# Altium project PCB_Project1.PrjPCB
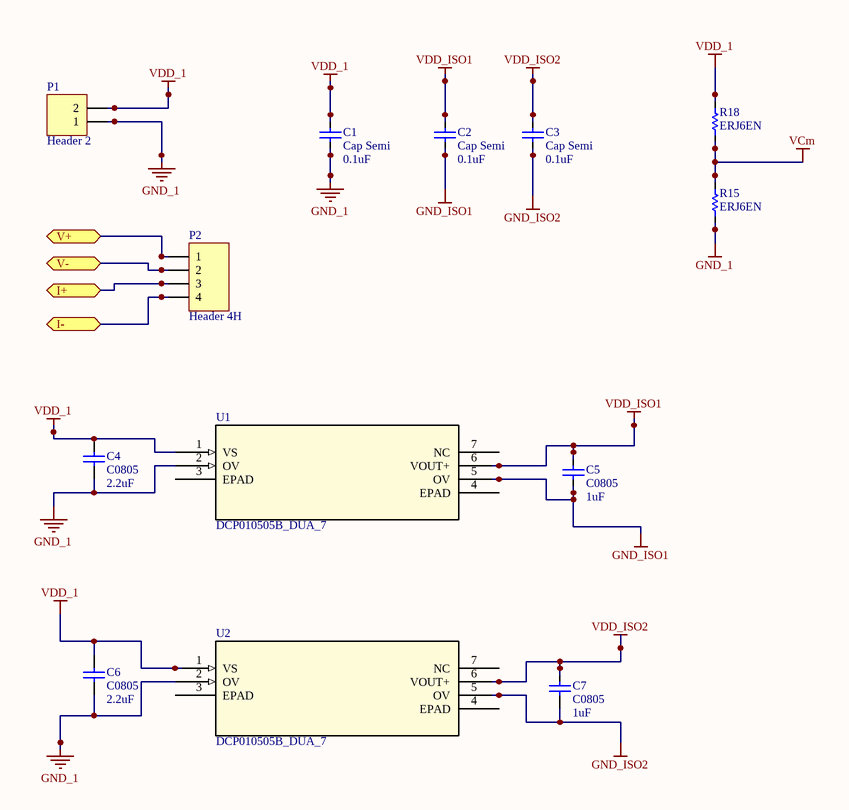
[diagram p0: Sheet1.SchDoc]
3 sheets, 40 parts. Net scope: flat (ports and power ports of the same name join across sheets).
Board file: PCB1.PcbDoc
Sheets:
  Sheet1.SchDoc
  Sheet2.SchDoc
  Sheet3.SchDoc

## Sheet Sheet1.SchDoc
size A4

### Parts
C1  Cap Semi  value 0.1uF  [C1206]
C2  Cap Semi  value 0.1uF  [C1206]
C3  Cap Semi  value 0.1uF  [C1206]
C4  C0805  value 2.2uF  [0805]
C5  C0805  value 1uF  [0805]
C6  C0805  value 2.2uF  [0805]
C7  C0805  value 1uF  [0805]
P1  Header 2  [HDR1X2]
P2  Header 4H  [HDR1X4H]
R15  ERJ6EN  [6-0805]
R18  ERJ6EN  [6-0805]
U1  DCP010505B_DUA_7  [DUA7]
U2  DCP010505B_DUA_7  [DUA7]

### Ports
I+, I-, V+, V-

### Nets
GND_1: C1.1 C4.1 C6.1 P1.1 R15.1 U1.2(OV) U2.2(OV)
GND_ISO1: C2.1 C5.1 U1.5(OV)
GND_ISO2: C3.1 C7.1 U2.5(OV)
VCm: R15.2 R18.1
VDD_1: C1.2 C4.2 C6.2 P1.2 R18.2 U1.1(VS) U2.1(VS)
VDD_ISO1: C2.2 C5.2 U1.6(VOUT+)
VDD_ISO2: C3.2 C7.2 U2.6(VOUT+)
NetC8_1: P2.4 ; port I-
NetP2_1: P2.1 ; port V+
NetP2_2: P2.2 ; port V-
NetP2_3: P2.3 ; port I+

Not connected (* = marked no-connect by the designer): U1 3(EPAD) 4(EPAD) 7(NC); U2 3(EPAD) 4(EPAD) 7(NC)

### Library data of the parts
C1-C3 = Cap Semi: Capacitor (Semiconductor SIM Model); Published: 8-Jun-2000; LatestRevisionDate: 29-May-2009; LatestRevisionNote: IPC-7351 Footprint Added.; PackageReference: C1206; Publisher: Altium Limited; PackageDescription: Chip Capacitor
C4-C7 = C0805: Ceramic Chip Capacitor - Standard; Note: Footprint corresponds to dimensions for bulk cassette packaging. This case size has tightened tolerances.; Published: 17-Jul-2002; LatestRevisionDate: 19-Mar-2004; LatestRevisionNote: Silkscreen size reduced.; DatasheetDocument: Mar-2001; PackageDocument: Mar-2001; PackageReference: 0805; Publisher: Altium Limited; Code_JEITA: 0805; Code_IPC: 2012[0805]; ComponentLink1Description: Manufacturer Link; ComponentLink1URL: http://www.kemet.com/; ComponentLink2Description: Datasheet; ComponentLink2URL: http://www.kemet.com/kemet/web/homepage/kechome.nsf/vapubfilesname/F3102TA.pdf/$file/F3102TA.pdf
P1 = Header 2: Header, 2-Pin; LatestRevisionDate: 17-Jul-2002; LatestRevisionNote: Re-released for DXP Platform.; Publisher: Altium Limited
P2 = Header 4H: Header, 4-Pin, Right Angle; LatestRevisionDate: 17-Jul-2002; LatestRevisionNote: Re-released for DXP Platform.; Publisher: Altium Limited
R15 R18 = ERJ6EN: Precision Thick Film Chip Resistor, 10 Ohm to 2.2M Ohm Range, 1% Tolerance, 0805 Size, 0.1 W; Published: 17-Dec-2003; LatestRevisionDate: 19-Mar-2004; LatestRevisionNote: Silkscreen size reduced.; PackageDocument: Mar-2003; PackageReference: 6-0805; Publisher: Altium Limited; Code_IPC: 2012 [0805]; ComponentLink1Description: Manufacturer Link; ComponentLink1URL: http://www.panasonic.com/industrial/components/resistive_products.htm; ComponentLink2Description: Datasheet; ComponentLink2URL: http://www.panasonic.com/industrial/components/pdf/AOA0000CE2.pdf
U1 U2 = DCP010505B_DUA_7: Imported; Manufacturer: Texas Instruments; INDUSTRY_STD_PKG_TYPE: SOP; FAMILY_NAME: 1 W AND 2 W MINIATURE; PIN_COUNT: 7; PACKAGE_DESIGNATOR: DUA; Datasheet_URL: http://www.ti.com/lit/gpn/DCP010505B; GENERIC_PART_NUMBER: DCP010505B; Value: Value; Type: Type; RefDes: RefDes

## Sheet Sheet2.SchDoc
size A4
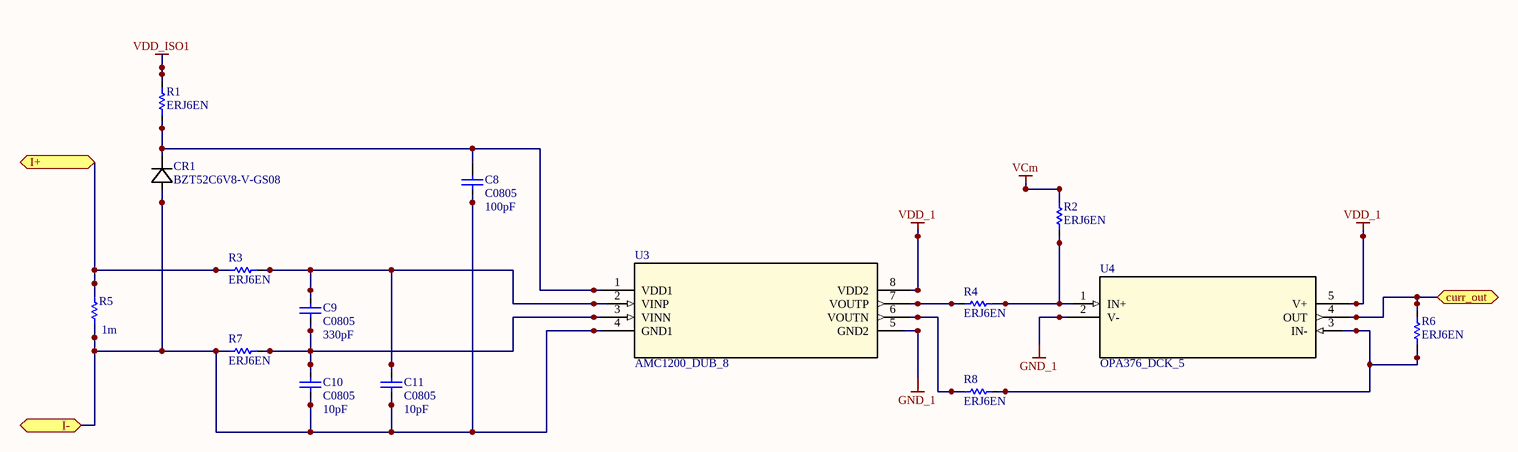
[diagram p1: Sheet2.SchDoc]

### Parts
C8  C0805  value 100pF  [0805]
C9  C0805  value 330pF  [0805]
C10  C0805  value 10pF  [0805]
C11  C0805  value 10pF  [0805]
CR1  BZT52C6V8-V-GS08  [SOD123]
R1  ERJ6EN  [6-0805]
R2  ERJ6EN  [6-0805]
R3  ERJ6EN  [6-0805]
R4  ERJ6EN  [6-0805]
R5  value 1m  [M1WT-2512]  (hidden comment: ERJM1WT)
R6  ERJ6EN  [6-0805]
R7  ERJ6EN  [6-0805]
R8  ERJ6EN  [6-0805]
U3  AMC1200_DUB_8  [DUB8]
U4  OPA376_DCK_5  [DCK5]

### Ports
curr_out, I+, I-

### Nets
GND_1: U3.5(GND2) U4.2(V-)
VCm: R2.2
VDD_1: U3.8(VDD2) U4.5(V+)
VDD_ISO1: R1.2
NetC8_1: C8.1 C10.1 C11.1 CR1.2 R5.1 R7.1 U3.4(GND1) ; port I-
NetC8_2: C8.2 CR1.1 R1.1 U3.1(VDD1)
NetC9_1: C9.1 C10.2 R7.2 U3.3(VINN)
NetC9_2: C9.2 C11.2 R3.2 U3.2(VINP)
NetP2_3: R3.1 R5.2 ; port I+
NetR2_1: R2.1 R4.2 U4.1(IN+)
NetR4_1: R4.1 U3.7(VOUTP)
NetR6_1: R6.1 R8.2 U4.3(IN-)
NetR6_2: R6.2 U4.4(OUT) ; port curr_out
NetR8_1: R8.1 U3.6(VOUTN)

### Library data of the parts
C8-C11 = C0805: as C4 on sheet Sheet1; Published: 17-Jul-2002; LatestRevisionDate: 19-Mar-2004; LatestRevisionNote: Silkscreen size reduced.; DatasheetDocument: Mar-2001; PackageDocument: Mar-2001; PackageReference: 0805; Publisher: Altium Limited; Code_JEITA: 0805; Code_IPC: 2012[0805]; ComponentLink1Description: Manufacturer Link; ComponentLink1URL: http://www.kemet.com/; ComponentLink2Description: Datasheet; ComponentLink2URL: http://www.kemet.com/kemet/web/homepage/kechome.nsf/vapubfilesname/F3102TA.pdf/$file/F3102TA.pdf
CR1 = BZT52C6V8-V-GS08: Imported; Vendor: Vishay; Built_By: EMA_UL_Team; C: Copyright (C) 2015 Accelerated Designs. All rights reserved; Manufacturer_Part_Number: BZT52C6V8-V-GS08; Value: Value
R1-R4 R6-R8 = ERJ6EN: as R15 on sheet Sheet1; Published: 17-Dec-2003; LatestRevisionDate: 19-Mar-2004; LatestRevisionNote: Silkscreen size reduced.; PackageDocument: Mar-2003; PackageReference: 6-0805; Publisher: Altium Limited; Code_IPC: 2012 [0805]; ComponentLink1Description: Manufacturer Link; ComponentLink1URL: http://www.panasonic.com/industrial/components/resistive_products.htm; ComponentLink2Description: Datasheet; ComponentLink2URL: http://www.panasonic.com/industrial/components/pdf/AOA0000CE2.pdf
R5 = ERJM1WT: Low Resistance Value Chip Resistor, 2m Ohm to 4m Ohm Range, 1% and 5% Tolerance, 2512 Size, 1 W; Note: See manufacturer datasheet for alternative land pattern; Published: 17-Dec-2003; LatestRevisionDate: 19-Mar-2004; LatestRevisionNote: Silkscreen size reduced.; PackageDocument: Mar-2003; PackageReference: M1WT-2512; Publisher: Altium Limited; ComponentLink1Description: Manufacturer Link; ComponentLink1URL: http://www.panasonic.com/industrial/components/resistive_products.htm; ComponentLink2Description: Datasheet; ComponentLink2URL: http://www.panasonic.com/industrial/components/pdf/AOA0000CE7.pdf
U3 = AMC1200_DUB_8: Imported; Manufacturer: Texas Instruments; INDUSTRY_STD_PKG_TYPE: SOP; FAMILY_NAME: ISOLATED ADC; PIN_COUNT: 8; PACKAGE_DESIGNATOR: DUB; Datasheet_URL: http://www.ti.com/lit/gpn/AMC1200; GENERIC_PART_NUMBER: AMC1200; Value: Value; Type: Type; RefDes: RefDes
U4 = OPA376_DCK_5: Imported; Manufacturer: Texas Instruments; GENERIC_PART_NUMBER: OPA376; INDUSTRY_STD_PKG_TYPE: SC70; FAMILY_NAME: LOW OFFSET VOLTAGE; PIN_COUNT: 5; PACKAGE_DESIGNATOR: DCK; Datasheet_URL: http://www.ti.com/lit/gpn/OPA376; Vendor: Texas Instruments; Manufacturer_Part_Number: opa376_dck_5; Value: Value; Type: Type; RefDes: RefDes

## Sheet Sheet3.SchDoc
size A4
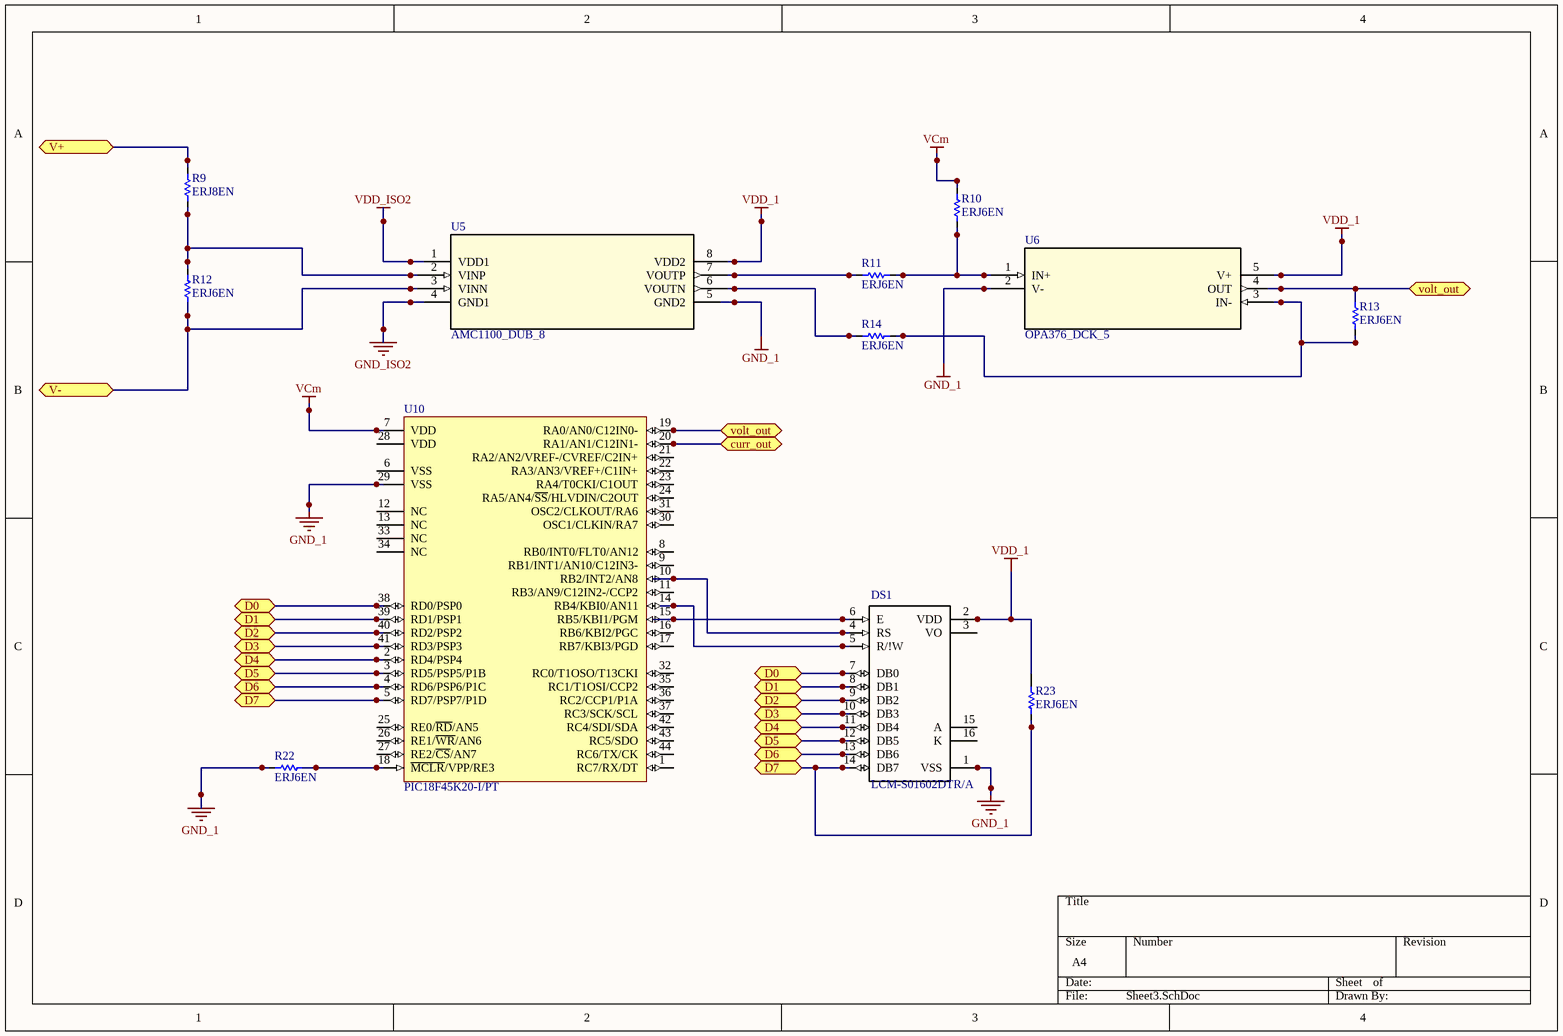
[diagram p2: Sheet3.SchDoc]

### Parts
DS1  LCM-S01602DTR/A  [LCD_LCM-S01602DTR/A]
R9  ERJ8EN  [8-1206]
R10  ERJ6EN  [6-0805]
R11  ERJ6EN  [6-0805]
R12  ERJ6EN  [6-0805]
R13  ERJ6EN  [6-0805]
R14  ERJ6EN  [6-0805]
R22  ERJ6EN  [6-0805]
R23  ERJ6EN  [6-0805]
U5  AMC1100_DUB_8  [DUB8]
U6  OPA376_DCK_5  [DCK5]
U10  PIC18F45K20-I/PT  [TQFP-PT44_N]

### Ports
curr_out, D0, D1, D2, D3, D4, D5, D6, D7, V+, V-, volt_out

### Nets
GND_1: DS1.1(VSS) R22.1 U5.5(GND2) U6.2(V-) U10.29(VSS)
GND_ISO2: U5.4(GND1)
VCm: R10.2 U10.7(VDD)
VDD_1: DS1.2(VDD) R23.2 U5.8(VDD2) U6.5(V+)
VDD_ISO2: U5.1(VDD1)
NetDS1_4: DS1.4(RS) U10.10(RB2/INT2/AN8)
NetDS1_5: DS1.5(R/!W) U10.14(RB4/KBI0/AN11)
NetDS1_6: DS1.6(E) U10.15(RB5/KBI1/PGM)
NetDS1_7: DS1.7(DB0) U10.38(RD0/PSP0) ; port D0
NetDS1_8: DS1.8(DB1) U10.39(RD1/PSP1) ; port D1
NetDS1_9: DS1.9(DB2) U10.40(RD2/PSP2) ; port D2
NetDS1_10: DS1.10(DB3) U10.41(RD3/PSP3) ; port D3
NetDS1_11: DS1.11(DB4) U10.2(RD4/PSP4) ; port D4
NetDS1_12: DS1.12(DB5) U10.3(RD5/PSP5/P1B) ; port D5
NetDS1_13: DS1.13(DB6) U10.4(RD6/PSP6/P1C) ; port D6
NetDS1_14: DS1.14(DB7) R23.1 U10.5(RD7/PSP7/P1D) ; port D7
NetP2_1: R9.2 ; port V+
NetP2_2: R12.1 U5.3(VINN) ; port V-
NetR6_2: U10.20(RA1/AN1/C12IN1-) ; port curr_out
NetR9_1: R9.1 R12.2 U5.2(VINP)
NetR10_1: R10.1 R11.2 U6.1(IN+)
NetR11_1: R11.1 U5.7(VOUTP)
NetR13_1: R13.1 R14.1 U6.3(IN-)
NetR13_2: R13.2 U6.4(OUT) U10.19(RA0/AN0/C12IN0-) ; port volt_out
NetR14_2: R14.2 U5.6(VOUTN)
NetR22_2: R22.2 U10.18(~{MCLR}/VPP/RE3)

Not connected (* = marked no-connect by the designer): DS1 3(VO) 15(A) 16(K); U10 1(RC7/RX/DT) 6(VSS) 8(RB0/INT0/FLT0/AN12) 9(RB1/INT1/AN10/C12IN3-) 11(RB3/AN9/C12IN2-/CCP2) 12(NC) 13(NC) 16(RB6/KBI2/PGC) 17(RB7/KBI3/PGD) 21(RA2/AN2/VREF-/CVREF/C2IN+) 22(RA3/AN3/VREF+/C1IN+) 23(RA4/T0CKI/C1OUT) 24(RA5/AN4/~{SS}/HLVDIN/C2OUT) 25(RE0/~{RD}/AN5) 26(RE1/~{WR}/AN6) 27(RE2/~{CS}/AN7) 28(VDD) 30(OSC1/CLKIN/RA7) 31(OSC2/CLKOUT/RA6) 32(RC0/T1OSO/T13CKI) 33(NC) 34(NC) 35(RC1/T1OSI/CCP2) 36(RC2/CCP1/P1A) 37(RC3/SCK/SCL) 42(RC4/SDI/SDA) 43(RC5/SDO) 44(RC6/TX/CK)

### Library data of the parts
DS1 = LCM-S01602DTR/A: Module, LCD; 16 x 2 mm; 5 x 8; 5 V (Typ.); 2 mA (Typ.); 4.2 V @50 degC (Min.); MF: Lumex; SnapEDA_Link: https://www.snapeda.com/parts/LCM-S01602DTR/A/Lumex%20Opto/Components%20Inc/view-part/?ref=snap; MP: LCM-S01602DTR/A; Package: None; Price: 7.47 USD; Availability: Warning; Value: *
R9 = ERJ8EN: Precision Thick Film Chip Resistor, 10 Ohm to 2.2M Ohm Range, 1% Tolerance, 1206 Size, 0.125 W; Published: 17-Dec-2003; LatestRevisionDate: 19-Mar-2004; LatestRevisionNote: Silkscreen size reduced.; PackageDocument: Mar-2003; PackageReference: 8-1206; Publisher: Altium Limited; Code_IPC: 3216 [1206]; ComponentLink1Description: Manufacturer Link; ComponentLink1URL: http://www.panasonic.com/industrial/components/resistive_products.htm; ComponentLink2Description: Datasheet; ComponentLink2URL: http://www.panasonic.com/industrial/components/pdf/AOA0000CE2.pdf
R10-R14 R22 R23 = ERJ6EN: as R15 on sheet Sheet1; Published: 17-Dec-2003; LatestRevisionDate: 19-Mar-2004; LatestRevisionNote: Silkscreen size reduced.; PackageDocument: Mar-2003; PackageReference: 6-0805; Publisher: Altium Limited; Code_IPC: 2012 [0805]; ComponentLink1Description: Manufacturer Link; ComponentLink1URL: http://www.panasonic.com/industrial/components/resistive_products.htm; ComponentLink2Description: Datasheet; ComponentLink2URL: http://www.panasonic.com/industrial/components/pdf/AOA0000CE2.pdf
U5 = AMC1100_DUB_8: Imported; Manufacturer: Texas Instruments; GENERIC_PART_NUMBER: AMC1200; INDUSTRY_STD_PKG_TYPE: SOP; FAMILY_NAME: ISOLATED ADC; PIN_COUNT: 8; PACKAGE_DESIGNATOR: DUB; Datasheet_URL: http://www.ti.com/lit/gpn/AMC1200; Value: Value; Type: Type; RefDes: RefDes
U6 = OPA376_DCK_5: as U4 on sheet Sheet2; Datasheet_URL: http://www.ti.com/lit/gpn/OPA376; Vendor: Texas Instruments; Manufacturer_Part_Number: opa376_dck_5; Value: Value; Type: Type; RefDes: RefDes
U10 = PIC18F45K20-I/PT: Flash Microcontroller with 10-Bit A/D and nanoWatt Technology, 32K Flash, 44-Pin TQFP, Industrial Temperature Range; Published: 29-Jan-2009; LatestRevisionDate: 02-Dec-2009; LatestRevisionNote: Updated to datasheet revision F, Sep-2009; DatasheetVersion: revF, Sep-2009; PackageVersion: revBB, Aug-2009; PackageReference: TQFP-PT44; Publisher: Altium Limited; PackageDescription: 44-Lead Plastic Thin Quad Flatpack (PT) - 10x10x1mm Body, 2.00mm [TQFP]; Supplier 1: Digi-Key; Supplier Part Number 1: PIC18F45K20-I/PT-ND; Supplier 2: Farnell; Supplier Part Number 2: 1439589; Code_JEDEC: MS-026; ComponentLink1Description: Datasheet; ComponentLink1URL: http://ww1.microchip.com/downloads/en/DeviceDoc/41303F.pdf; ComponentLink2Description: Packaging Specification; ComponentLink2URL: http://www.microchip.com/stellent/groups/techpub_sg/documents/packagingspec/en012702.pdf; ComponentLink3Description: Microchip.com Home; ComponentLink3URL: http://www.microchip.com/

## Nets that join several sheets
GND_1: Sheet1 (7 pins), Sheet2 (U3.5 U4.2), Sheet3 (5 pins)
GND_ISO2: Sheet1 (C3.1 C7.1 U2.5), Sheet3 (U5.4)
VCm: Sheet1 (R15.2 R18.1), Sheet2 (R2.2), Sheet3 (R10.2 U10.7)
VDD_1: Sheet1 (7 pins), Sheet2 (U3.8 U4.5), Sheet3 (DS1.2 R23.2 U5.8 U6.5)
VDD_ISO1: Sheet1 (C2.2 C5.2 U1.6), Sheet2 (R1.2)
VDD_ISO2: Sheet1 (C3.2 C7.2 U2.6), Sheet3 (U5.1)
NetC8_1: Sheet1 (P2.4), Sheet2 (7 pins)
NetP2_1: Sheet1 (P2.1), Sheet3 (R9.2)
NetP2_2: Sheet1 (P2.2), Sheet3 (R12.1 U5.3)
NetP2_3: Sheet1 (P2.3), Sheet2 (R3.1 R5.2)
NetR6_2: Sheet2 (R6.2 U4.4), Sheet3 (U10.20)